# EAGLE schematic megacommand24 (EAGLE 7.6.0)

## Sheet 1 of 5
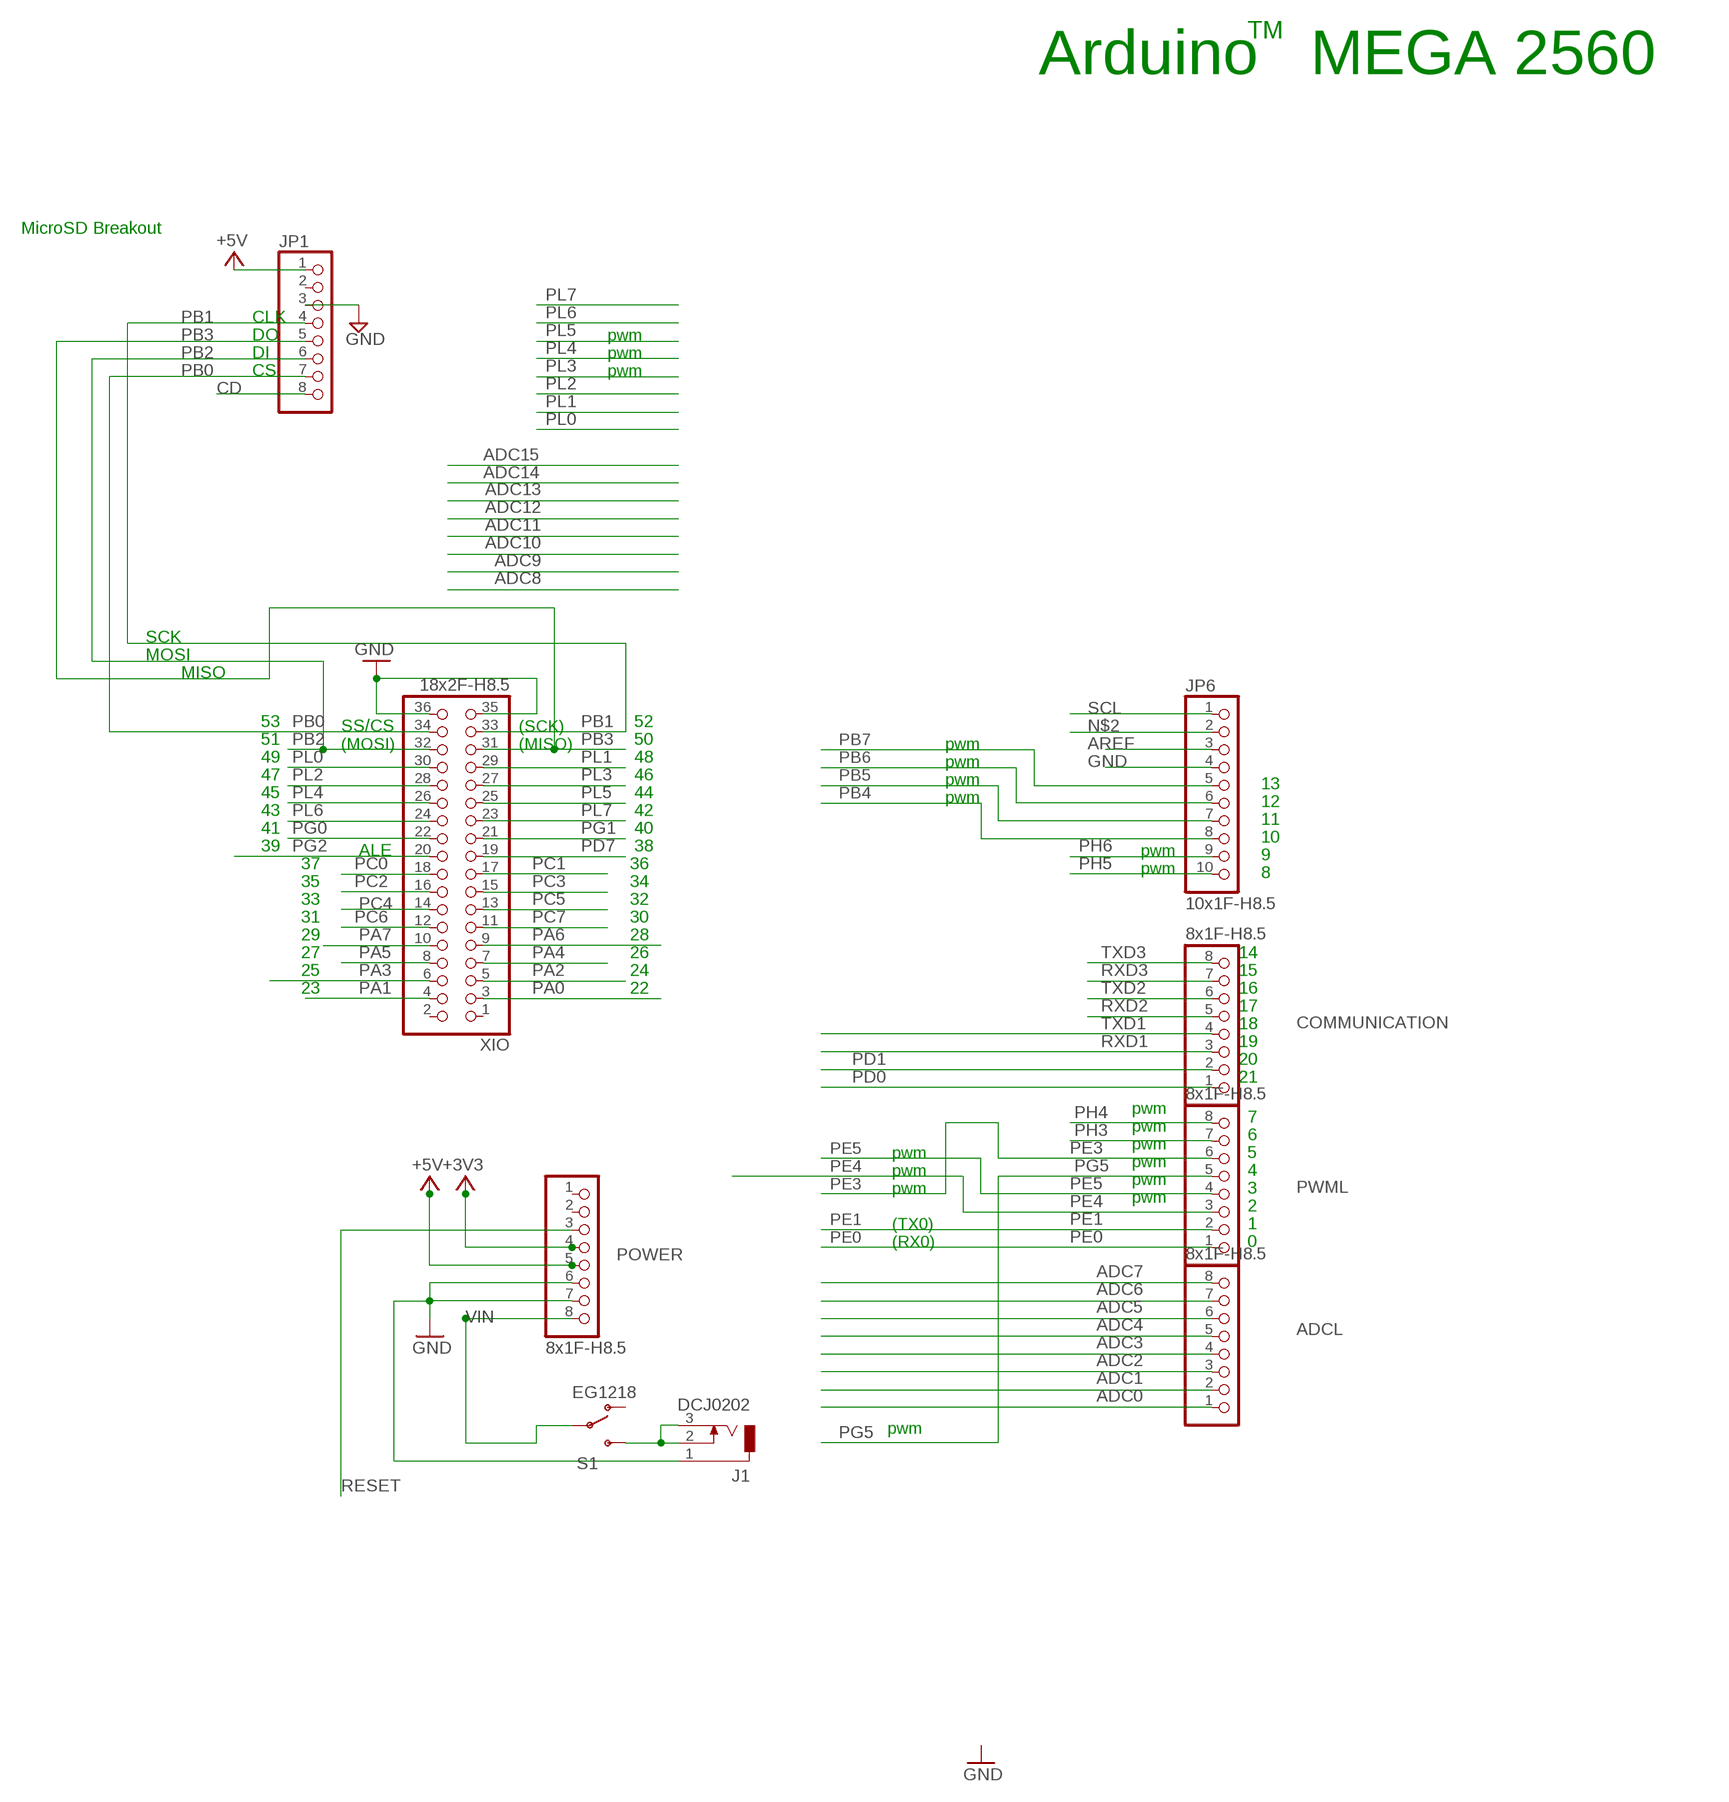
[diagram p0: schematic, sheet 1]

### Parts
ADCL  8x1F-H8.5  PINHD-1X8  [1X08]
COMMUNICATION  8x1F-H8.5  PINHD-1X8  [1X08]
J1  DCJ0202  [DCJ0202]
JP1  PINHD-1X8BIG  [1X08-BIG]
JP6  10x1F-H8.5  PINHD-1X10_ARD  [1X10]
POWER  8x1F-H8.5  PINHD-1X8  [1X08]
PWML  8x1F-H8.5  PINHD-1X8  [1X08]
S1  EG1218  SWITCH-SPDTKIT  [SWITCH-SPDT_KIT]
XIO  18x2F-H8.5  PINHD-2X18  [2X18]

### Nets
+3V3 [power]: POWER.4 ; also sheet 3
+5V: JP1.1 POWER.5 ; also sheet 2,3,4,5
ADC0: ADCL.1 ; also sheet 3
ADC1: ADCL.2 ; also sheet 3
ADC2: ADCL.3 ; also sheet 3
ADC3: ADCL.4 ; also sheet 3
ADC4: ADCL.5
ADC5: ADCL.6
ADC6: ADCL.7
ADC7: ADCL.8
AREF: JP6.3
CD: JP1.8
GND: J1.1 JP1.3 JP6.4 POWER.6 POWER.7 XIO.35 XIO.36 ; also sheet 2,3,4,5
N$2: JP6.2
N$23: J1.2 J1.3 S1.3(S)
PA0: XIO.3 ; also sheet 4
PA1: XIO.4 ; also sheet 4
PA2: XIO.5 ; also sheet 4
PA3: XIO.6 ; also sheet 4
PA4: XIO.7 ; also sheet 4
PA5: XIO.8 ; also sheet 4
PA6: XIO.9 ; also sheet 4
PA7: XIO.10 ; also sheet 4
PB0: JP1.7 XIO.34
PB1: JP1.4 XIO.33 ; also sheet 3
PB2: JP1.6 XIO.32 ; also sheet 3
PB3: JP1.5 XIO.31
PB4: JP6.8
PB5: JP6.7
PB6: JP6.6
PB7: JP6.5
PC0: XIO.18 ; also sheet 4
PC1: XIO.17 ; also sheet 4
PC2: XIO.16 ; also sheet 4
PC3: XIO.15 ; also sheet 4
PC4: XIO.14 ; also sheet 4
PC5: XIO.13 ; also sheet 4
PC6: XIO.12 ; also sheet 4
PC7: XIO.11 ; also sheet 4
PD0: COMMUNICATION.1
PD1: COMMUNICATION.2
PD7: XIO.19 ; also sheet 3
PE0: PWML.1
PE1: PWML.2
PE3: PWML.6
PE4: PWML.3 ; also sheet 3
PE5: PWML.4 ; also sheet 3
PG0: XIO.22 ; also sheet 4
PG1: XIO.21 ; also sheet 4
PG2: XIO.20 ; also sheet 4
PG5: PWML.5
PH3: PWML.7
PH4: PWML.8
PH5: JP6.10
PH6: JP6.9
PL0: XIO.30 ; also sheet 2
PL1: XIO.29 ; also sheet 2
PL2: XIO.28 ; also sheet 2
PL3: XIO.27 ; also sheet 3
PL4: XIO.26 ; also sheet 3
PL5: XIO.25 ; also sheet 3
PL6: XIO.24 ; also sheet 4
PL7: XIO.23 ; also sheet 3
RESET: POWER.3
RXD1: COMMUNICATION.3 ; also sheet 5
RXD2: COMMUNICATION.5 ; also sheet 5
RXD3: COMMUNICATION.7
SCL: JP6.1
TXD1: COMMUNICATION.4 ; also sheet 5
TXD2: COMMUNICATION.6 ; also sheet 5
TXD3: COMMUNICATION.8
VIN: POWER.8 S1.2(P)
Unconnected: JP1.2 POWER.1 POWER.2 S1.1(O) XIO.1 XIO.2

### Notes on the sheet
- TM
- Arduino   MEGA 2560
- MicroSD Breakout
- CLK
- DO | pwm
- DI | pwm
- CS | pwm
- SCK
- MOSI
- MISO
- 53 | SS/CS | (SCK) | 52
- 51 | (MOSI) | (MISO) | 50 | pwm
- 49 | 48 | pwm
- 47 | 46 | pwm
- 13
- 45 | 44 | pwm
- 12
- 43 | 42
- 11
- 41 | 40
- 10
- 39 | ALE | 38 | pwm
- 9
- 37 | 36 | pwm
- 8
- 35 | 34
- 33 | 32
- 31 | 30
- 29 | 28
- 27 | 26 | 14
- 25 | 24 | 15
- 23 | 22 | 16
- 17
- 18
- 19
- 20
- 21
- pwm
- 7
- pwm
- 6
- pwm
- pwm | 5
- pwm
- pwm | 4
- pwm
- pwm | 3
- pwm
- 2
- (TX0) | 1
- (RX0) | 0
- pwm

## Sheet 2 of 5
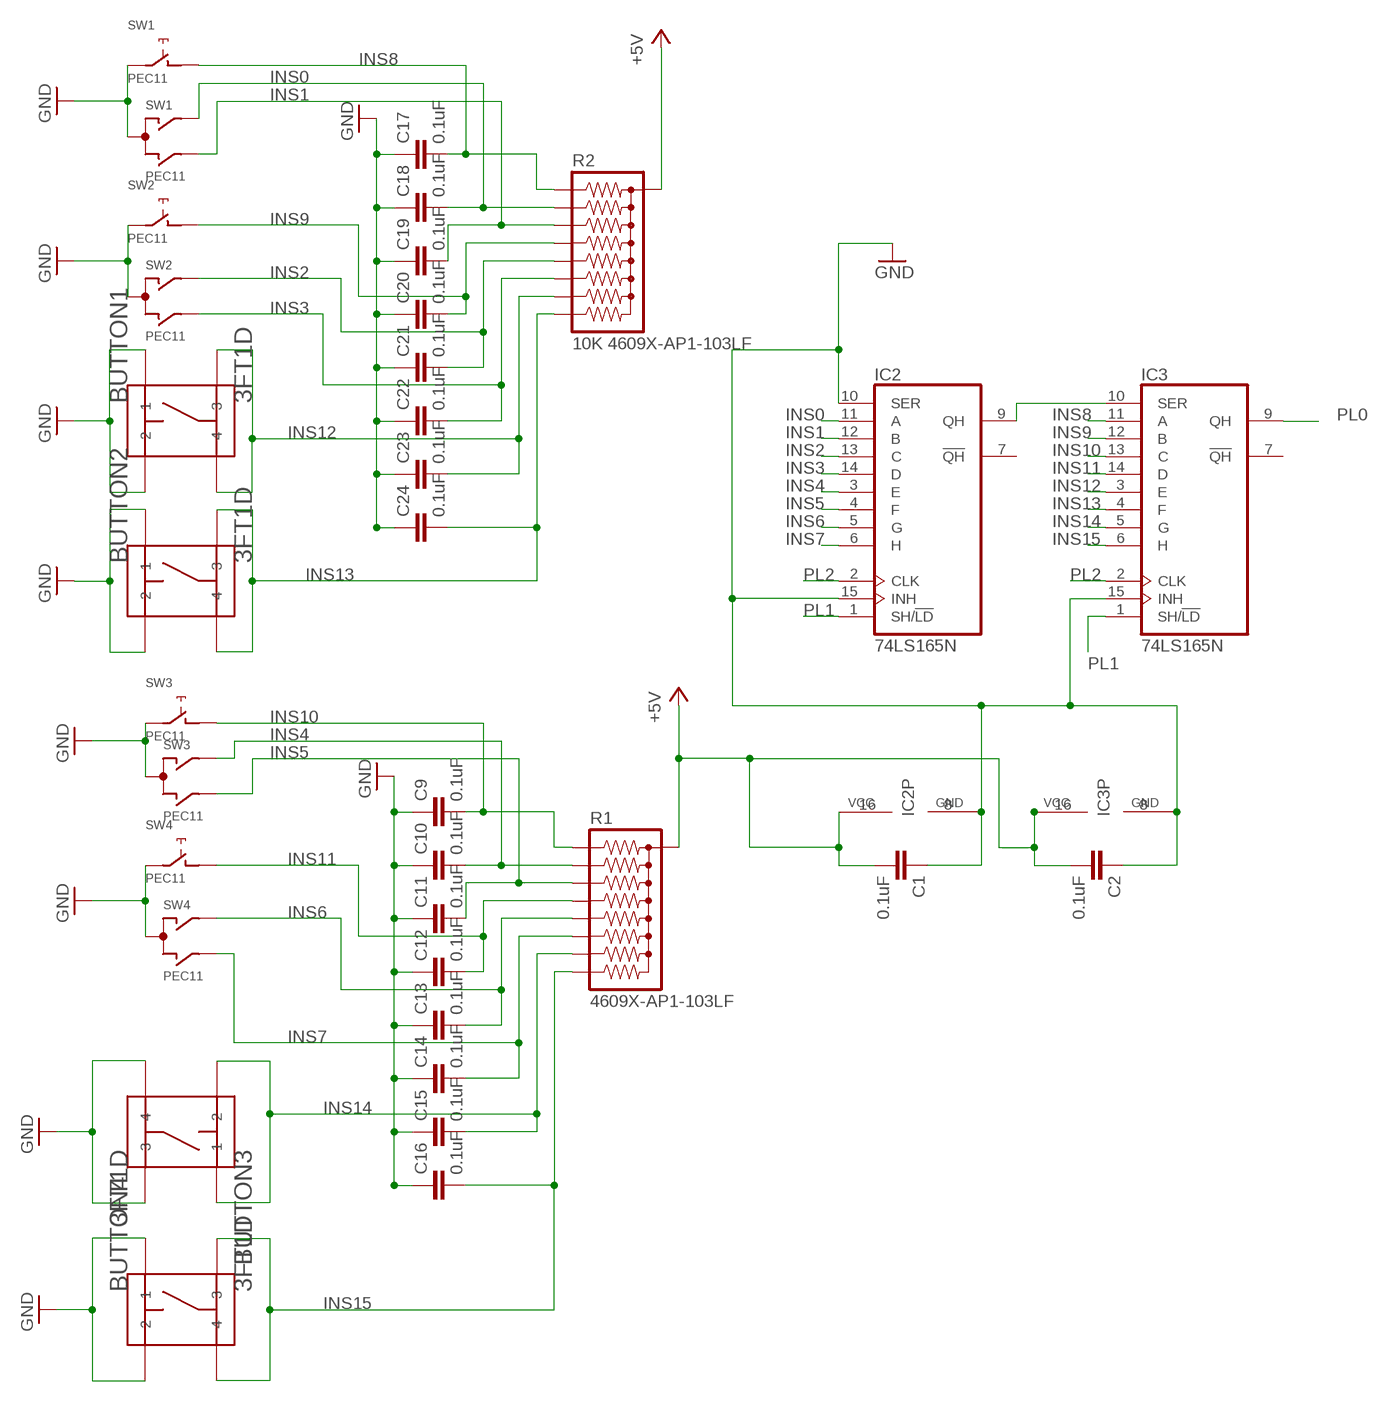
[diagram p1: schematic, sheet 2]

### Parts
BUTTON1  3FT1D  [3FT]
BUTTON2  3FT1D  [3FT]
BUTTON3  3FT1D  [3FT]
BUTTON4  3FT1D  [3FT]
C1  0.1uF  C-EU025-050X050  [C025-050X050]
C2  0.1uF  C-EU025-050X050  [C025-050X050]
C9  0.1uF  C-EU025-050X050  [C025-050X050]
C10  0.1uF  C-EU025-050X050  [C025-050X050]
C11  0.1uF  C-EU025-050X050  [C025-050X050]
C12  0.1uF  C-EU025-050X050  [C025-050X050]
C13  0.1uF  C-EU025-050X050  [C025-050X050]
C14  0.1uF  C-EU025-050X050  [C025-050X050]
C15  0.1uF  C-EU025-050X050  [C025-050X050]
C16  0.1uF  C-EU025-050X050  [C025-050X050]
C17  0.1uF  C-EU025-050X050  [C025-050X050]
C18  0.1uF  C-EU025-050X050  [C025-050X050]
C19  0.1uF  C-EU025-050X050  [C025-050X050]
C20  0.1uF  C-EU025-050X050  [C025-050X050]
C21  0.1uF  C-EU025-050X050  [C025-050X050]
C22  0.1uF  C-EU025-050X050  [C025-050X050]
C23  0.1uF  C-EU025-050X050  [C025-050X050]
C24  0.1uF  C-EU025-050X050  [C025-050X050]
IC2  74LS165N  [DIL16]
IC3  74LS165N  [DIL16]
R1  4609X-AP1-103LF  RPACK-BUSSED-8-SIP-PTH-8  [RPACK-SIP-PTH-8]
R2  10K 4609X-AP1-103LF  RPACK-BUSSED-8-SIP-PTH-8  [RPACK-SIP-PTH-8]
SW1  PEC11  EC12E_SW  [ALPS_EC12E_SW]
SW2  PEC11  EC12E_SW  [ALPS_EC12E_SW]
SW3  PEC11  EC12E_SW  [ALPS_EC12E_SW]
SW4  PEC11  EC12E_SW  [ALPS_EC12E_SW]

### Nets
+5V: C1.2 C2.2 IC2.16(VCC) IC3.16(VCC) R1.P$1 R2.P$1 ; also sheet 1,3,4,5
GND: BUTTON1.P$1 BUTTON1.P$2 BUTTON2.P$1 BUTTON2.P$2 BUTTON3.P$3 BUTTON3.P$4 BUTTON4.P$1 BUTTON4.P$2 C1.1 C2.1 C9.1 C10.1 C11.1 C12.1 C13.1 C14.1 C15.1 C16.1 C17.1 C18.1 C19.1 C20.1 C21.1 C22.1 C23.1 C24.1 IC2.8(GND) IC2.10(SER) IC2.15(INH) IC3.8(GND) IC3.15(INH) SW1.C SW1.E SW2.C SW2.E SW3.C SW3.E SW4.C SW4.E ; also sheet 1,3,4,5
INS0: C18.2 IC2.11(A) R2.P$3 SW1.A
INS1: C19.2 IC2.12(B) R2.P$4 SW1.B
INS2: C21.2 IC2.13(C) R2.P$6 SW2.A
INS3: C22.2 IC2.14(D) R2.P$7 SW2.B
INS4: C10.2 IC2.3(E) R1.P$3 SW3.A
INS5: C11.2 IC2.4(F) R1.P$4 SW3.B
INS6: C13.2 IC2.5(G) R1.P$6 SW4.A
INS7: C14.2 IC2.6(H) R1.P$7 SW4.B
INS8: C17.2 IC3.11(A) R2.P$2 SW1.D
INS9: C20.2 IC3.12(B) R2.P$5 SW2.D
INS10: C9.2 IC3.13(C) R1.P$2 SW3.D
INS11: C12.2 IC3.14(D) R1.P$5 SW4.D
INS12: BUTTON1.P$3 BUTTON1.P$4 C23.2 IC3.3(E) R2.P$8
INS13: BUTTON2.P$3 BUTTON2.P$4 C24.2 IC3.4(F) R2.P$9
INS14: BUTTON3.P$1 BUTTON3.P$2 C15.2 IC3.5(G) R1.P$8
INS15: BUTTON4.P$3 BUTTON4.P$4 C16.2 IC3.6(H) R1.P$9
N$12: IC2.9(QH) IC3.10(SER)
PL0: IC3.9(QH) ; also sheet 1
PL1: IC2.1(SH/!LD) IC3.1(SH/!LD) ; also sheet 1
PL2: IC2.2(CLK) IC3.2(CLK) ; also sheet 1
Unconnected: IC2.7(!QH) IC3.7(!QH) SW1.GND1(GND1:G) SW1.GND2(GND2:G) SW2.GND1(GND1:G) SW2.GND2(GND2:G) SW3.GND1(GND1:G) SW3.GND2(GND2:G) SW4.GND1(GND1:G) SW4.GND2(GND2:G)

## Sheet 3 of 5
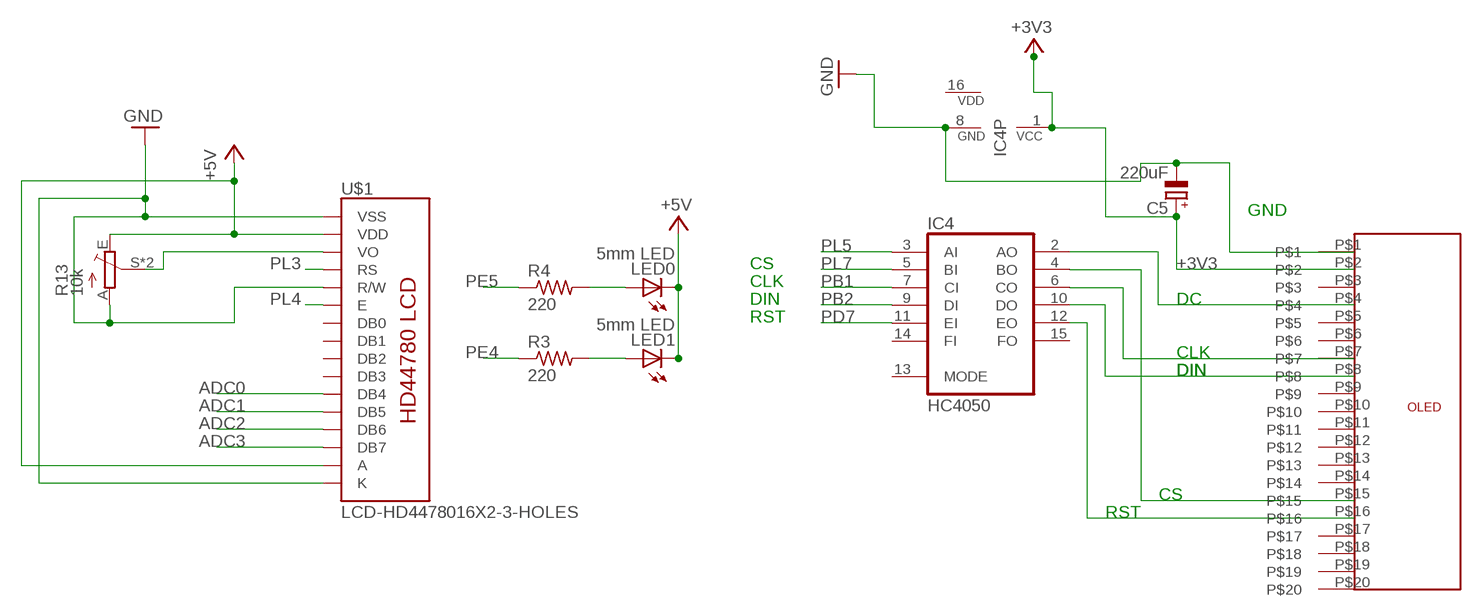
[diagram p2: schematic, sheet 3]

### Parts
C5  220uF  CPOL-EUTT2D6  [TT2D6]
IC4  HC4050  4504N  [DIL16]
LED0  5mm LED  LED_ELD260  [LED_LD260]
LED1  5mm LED  LED_ELD260  [LED_LD260]
R3  220  R-US_0207/7  [0207/7]
R4  220  R-US_0207/7  [0207/7]
R13  10k  TRIM_EU-CA6V  [CA6V]
U$1  LCD-HD4478016X2-3-HOLES  [LCD-16X2-3HOLES]
U$2  20PIN  [20PIN]

### Nets
+3V3 [power]: C5.+ IC4.1(VCC) U$2.P$2 ; also sheet 1
+5V: LED0.K(C) LED1.K(C) R13.E U$1.2(VDD) U$1.15(A) ; also sheet 1,2,4,5
ADC0: U$1.11(DB4) ; also sheet 1
ADC1: U$1.12(DB5) ; also sheet 1
ADC2: U$1.13(DB6) ; also sheet 1
ADC3: U$1.14(DB7) ; also sheet 1
GND: C5.- IC4.8(GND) R13.A U$1.1(VSS) U$1.5(R/W) U$1.16(K) U$2.P$1 ; also sheet 1,2,4,5
N$3: LED0.A R4.2
N$13: LED1.A R3.2
N$25: IC4.2(AO) U$2.P$4
N$27: R13.S R13.S1(S) U$1.3(VO)
N$28: IC4.6(CO) U$2.P$7
N$29: IC4.10(DO) U$2.P$8
N$30: IC4.4(BO) U$2.P$15
N$31: IC4.12(EO) U$2.P$16
PB1: IC4.7(CI) ; also sheet 1
PB2: IC4.9(DI) ; also sheet 1
PD7: IC4.11(EI) ; also sheet 1
PE4: R3.1 ; also sheet 1
PE5: R4.1 ; also sheet 1
PL3: U$1.4(RS) ; also sheet 1
PL4: U$1.6(E) ; also sheet 1
PL5: IC4.3(AI) ; also sheet 1
PL7: IC4.5(BI) ; also sheet 1
Unconnected: IC4.13(MODE) IC4.14(FI) IC4.15(FO) U$1.7(DB0) U$1.8(DB1) U$1.9(DB2) U$1.10(DB3) U$2.P$3 U$2.P$5 U$2.P$6 U$2.P$9 U$2.P$10 U$2.P$11 U$2.P$12 U$2.P$13 U$2.P$14 U$2.P$17 U$2.P$18 U$2.P$19 U$2.P$20

### Notes on the sheet
- GND
- CS
- CLK
- DIN | DC
- RST
- CLK
- DIN | DIN
- CS
- RST

## Sheet 4 of 5
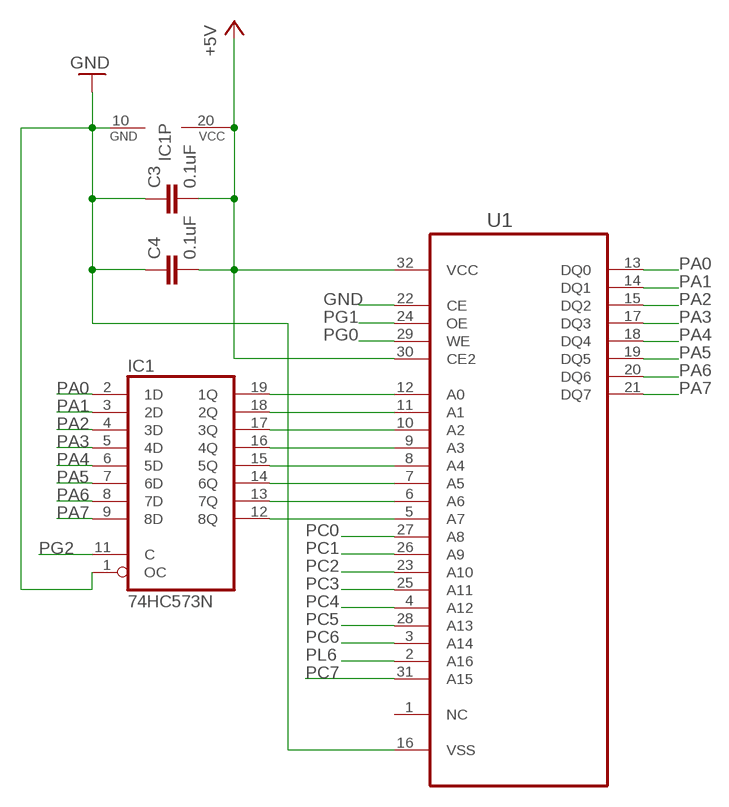
[diagram p3: schematic, sheet 4]

### Parts
C3  0.1uF  C-EU025-050X050  [C025-050X050]
C4  0.1uF  C-EU025-050X050  [C025-050X050]
IC1  74HC573N  [DIL20]
U1  AS6C1008-55PCN  [DIP254P1524X393-32]

### Nets
+5V: C3.2 C4.2 IC1.20(VCC) U1.30(CE2) U1.32(VCC) ; also sheet 1,2,3,5
GND: C3.1 C4.1 IC1.1(OC) IC1.10(GND) U1.16(VSS) U1.22(CE) ; also sheet 1,2,3,5
N$4: IC1.13(7Q) U1.6(A6)
N$5: IC1.19(1Q) U1.12(A0)
N$6: IC1.18(2Q) U1.11(A1)
N$7: IC1.17(3Q) U1.10(A2)
N$8: IC1.16(4Q) U1.9(A3)
N$9: IC1.15(5Q) U1.8(A4)
N$10: IC1.14(6Q) U1.7(A5)
N$11: IC1.12(8Q) U1.5(A7)
PA0: IC1.2(1D) U1.13(DQ0) ; also sheet 1
PA1: IC1.3(2D) U1.14(DQ1) ; also sheet 1
PA2: IC1.4(3D) U1.15(DQ2) ; also sheet 1
PA3: IC1.5(4D) U1.17(DQ3) ; also sheet 1
PA4: IC1.6(5D) U1.18(DQ4) ; also sheet 1
PA5: IC1.7(6D) U1.19(DQ5) ; also sheet 1
PA6: IC1.8(7D) U1.20(DQ6) ; also sheet 1
PA7: IC1.9(8D) U1.21(DQ7) ; also sheet 1
PC0: U1.27(A8) ; also sheet 1
PC1: U1.26(A9) ; also sheet 1
PC2: U1.23(A10) ; also sheet 1
PC3: U1.25(A11) ; also sheet 1
PC4: U1.4(A12) ; also sheet 1
PC5: U1.28(A13) ; also sheet 1
PC6: U1.3(A14) ; also sheet 1
PC7: U1.31(A15) ; also sheet 1
PG0: U1.29(WE) ; also sheet 1
PG1: U1.24(OE) ; also sheet 1
PG2: IC1.11(C) ; also sheet 1
PL6: U1.2(A16) ; also sheet 1
Unconnected: U1.1(NC)

## Sheet 5 of 5
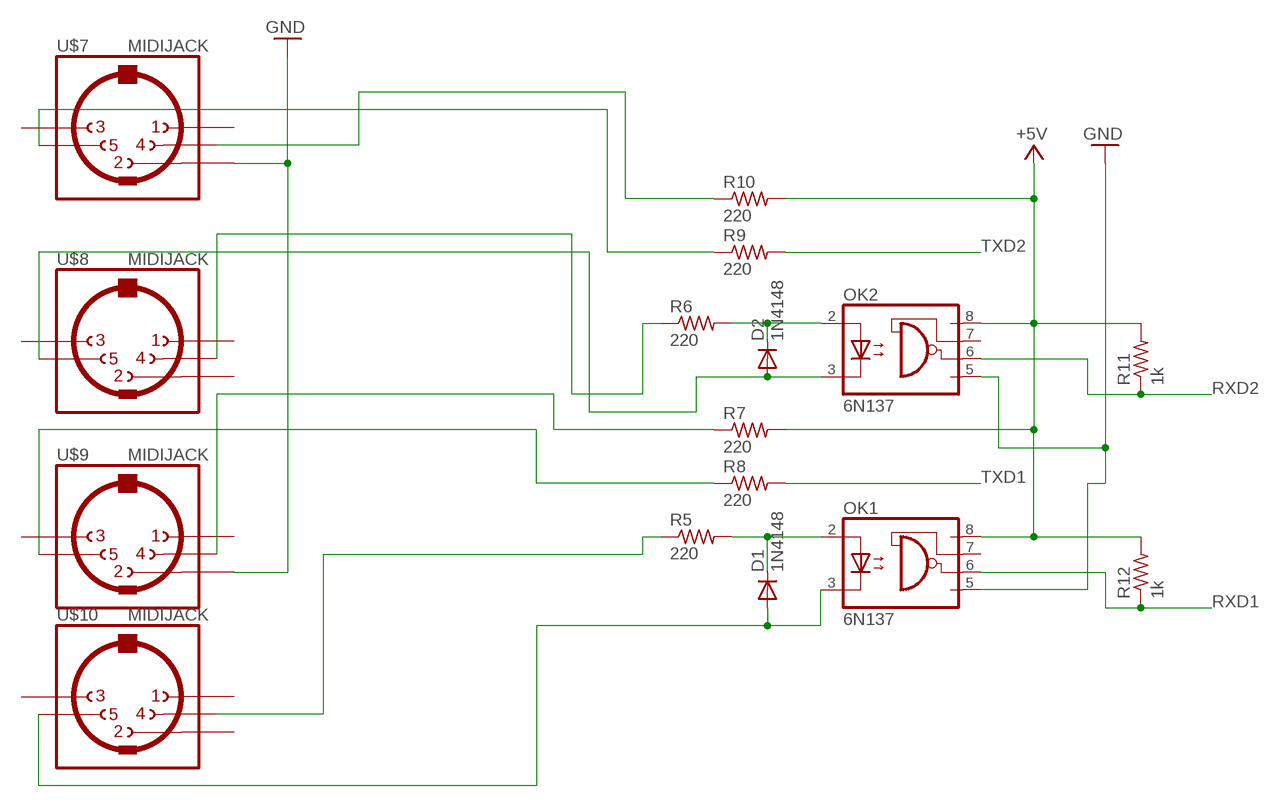
[diagram p4: schematic, sheet 5]

### Parts
D1  1N4148  1N4148DO35-7  [DO35-7]
D2  1N4148  1N4148DO35-7  [DO35-7]
OK1  6N137  [DIL08]
OK2  6N137  [DIL08]
R5  220  R-US_0207/7  [0207/7]
R6  220  R-US_0207/7  [0207/7]
R7  220  R-US_0207/7  [0207/7]
R8  220  R-US_0207/7  [0207/7]
R9  220  R-US_0207/7  [0207/7]
R10  220  R-US_0207/7  [0207/7]
R11  1k  R-US_0207/7  [0207/7]
R12  1k  R-US_0207/7  [0207/7]
U$7  MIDIJACK  [CP-2350]
U$8  MIDIJACK  [CP-2350]
U$9  MIDIJACK  [CP-2350]
U$10  MIDIJACK  [CP-2350]

### Nets
+5V: OK1.8(VCC) OK2.8(VCC) R7.2 R10.2 R11.2 R12.2 ; also sheet 1,2,3,4
GND: OK1.5(GND) OK2.5(GND) U$7.2 U$9.2 ; also sheet 1,2,3,4
N$1: R8.1 U$9.5
N$14: D1.A OK1.3(C) U$10.5
N$15: R5.1 U$10.4
N$16: R7.1 U$9.4
N$17: R10.1 U$7.4
N$18: D2.C OK2.2(A) R6.2
N$19: D2.A OK2.3(C) U$8.5
N$21: R6.1 U$8.4
N$22: R9.1 U$7.5
N$26: D1.C OK1.2(A) R5.2
RXD1: OK1.6(VO) R12.1 ; also sheet 1
RXD2: OK2.6(VO) R11.1 ; also sheet 1
TXD1: R8.2 ; also sheet 1
TXD2: R9.2 ; also sheet 1
Unconnected: OK1.7(VE) OK2.7(VE) U$7.1 U$7.3 U$8.1 U$8.2 U$8.3 U$9.1 U$9.3 U$10.1 U$10.2 U$10.3

## Power pins joined to a net without a drawn wire
VDD: IC4.16(VDD)

## Library data of the parts
ADCL COMMUNICATION POWER PWML = SmartPrj:PINHD-1X8: PIN HEADER
BUTTON1-BUTTON4 = mec switches:3FT1D: Mulitmec - 3FT1D <http://www.mec.dk/statisk.php4?id=504> Switch 3F - Through Hole with basic matt cover http://www.mec.dk
C1-C4 C9-C24 = rcl:C-EU: CAPACITOR, European symbol
C5 = resistor:CPOL-EU: POLARIZED CAPACITOR, European symbol
D1 D2 = diode:1N4148: DIODE high speed (Philips)
IC1 = 74xx-us:74*573: 8-bit D latch BUS DRIVER
IC2 IC3 = 74xx-us:74*165: 8-bit parallel load SHIFT REGISTER
IC4 = 45xx:4504: TTL or CMOS to CMOS hex LEVEL SHIFTER
J1 = con-jack:DCJ0202: DC POWER JACK Source: DCJ0202.pdf; OC_FARNELL: unknown; OC_NEWARK: unknown
JP1 = adafruit:PINHD-1X8: PIN HEADER
JP6 = SmartPrj:PINHD-1X10_ARD: PIN HEADER
LED0 LED1 = eagle-ltspice:LED_E: LED Source: http://www.osram.convergy.de Source: www.luxeon.com Source: www.kingbright.com; SPICEMODEL: NONE; SPICEPREFIX: D; SPICETYPE: diode
OK1 OK2 = optocoupler:6N137: MOTOROLA OPTO COUPLER; MPN: 6N137; OC_FARNELL: 1328376; OC_NEWARK: 52M1895
R1 R2 = SparkFun-Resistors:RPACK-BUSSED-8: BOURNS 4600X/R series thick-film SIP resistor packs Height resistors bussed to a single pin (denoted by dot). datasheet <http://dlnmh9ip6v2uc.cloudfront.net/datasheets/Components/General/4600x.pdf> SIMILAR TO: SFE parts COM-10855 (330), COM-10856 (10K)
R3-R12 = resistor:R-US_: RESISTOR, American symbol
R13 = pot:TRIM_EU-: POTENTIOMETER
S1 = SparkFun-Electromechanical:SWITCH-SPDT: SPDT Switch Simple slide switch, Spark Fun Electronics SKU : COM-00102 DPDT SMT slide switch, AYZ0202, SWCH-08179; PROD_ID: SWCH-08261
SW1-SW4 = pec11-n:EC12E_SW: ALPS rotary Encoder EC12E series with switch; MPN: EC12E2424407; OC_FARNELL: 1520813; OC_NEWARK: 74M1068
U1 = Alliance_Memory_By_element14_Batch_1:AS6C1008-55PCN: CMOS SRAM; MPN: AS6C1008-55PCN; OC_FARNELL: 1562896; OC_NEWARK: 94M6214; PACKAGE: DIP-32; SUPPLIER: ALLIANCE MEMORY
U$1 = HD44780LCD:LCD-HD44780
U$2 = OLED:20PIN
U$7-U$10 = adafruit_din:MIDIJACK: DIN 5 jack also known as MIDI jack A modification of conn-hirshman:MAB5SH with two options for the grounding 'teeth'
XIO = SmartPrj:PINHD-2X18: PIN HEADER

## Net classes
0 default: width 0.203 mm, drill 0.406 mm, clearance 0.203 mm
1 power: width 0.61 mm, drill 0.406 mm, clearance 0.203 mm
2 gnd: width 0.305 mm, drill 0.406 mm, clearance 0.203 mm
3 power usb: width 0.508 mm, drill 0.406 mm, clearance 0.203 mm